# EAGLE design ADC_final (EAGLE 7.6.0)
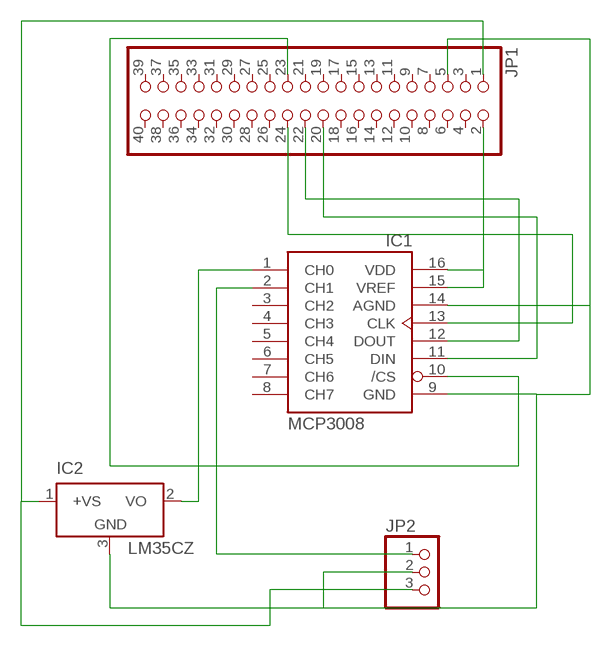
[diagram p0: schematic, sheet 1]

## Parts
IC1  MCP3008  [DIL16]
IC2  LM35CZ  [TO92]
JP1  PINHD-2X20  [2X20]
JP2  PINHD-1X3M  [1X03M]

## Nets
N$1: IC2.1(+VS) JP1.1 JP2.3
N$2: IC1.15(VREF) IC1.16(VDD) JP1.2
N$3: IC1.9(GND) IC1.14(AGND) IC2.3(GND) JP1.5 JP2.2
N$4: IC1.1(CH0) IC2.2(VO)
N$5: IC1.2(CH1) JP2.1
N$6: IC1.11(DIN) JP1.20
N$7: IC1.12(DOUT) JP1.22
N$8: IC1.13(CLK) JP1.24
N$9: IC1.10(/CS) JP1.23
Unconnected: IC1.3(CH2) IC1.4(CH3) IC1.5(CH4) IC1.6(CH5) IC1.7(CH6) IC1.8(CH7) JP1.3 JP1.4 JP1.6 JP1.7 JP1.8 JP1.9 JP1.10 JP1.11 JP1.12 JP1.13 JP1.14 JP1.15 JP1.16 JP1.17 JP1.18 JP1.19 JP1.21 JP1.25 JP1.26 JP1.27 JP1.28 JP1.29 JP1.30 JP1.31 JP1.32 JP1.33 JP1.34 JP1.35 JP1.36 JP1.37 JP1.38 JP1.39 JP1.40

## Library data of the parts
IC1 = adafruit:MCP3008
IC2 = lm35:LM35: Single-Supply Centigrade Temperature Sensor Vout = (10mV/°C x Temp °C) +5mmmV Source: http://www.national.com/ds/LM/LM35.pdf
JP1 = pinhead:PINHD-2X20: PIN HEADER
JP2 = pinhead:PINHD-1X3: PIN HEADER

## Board
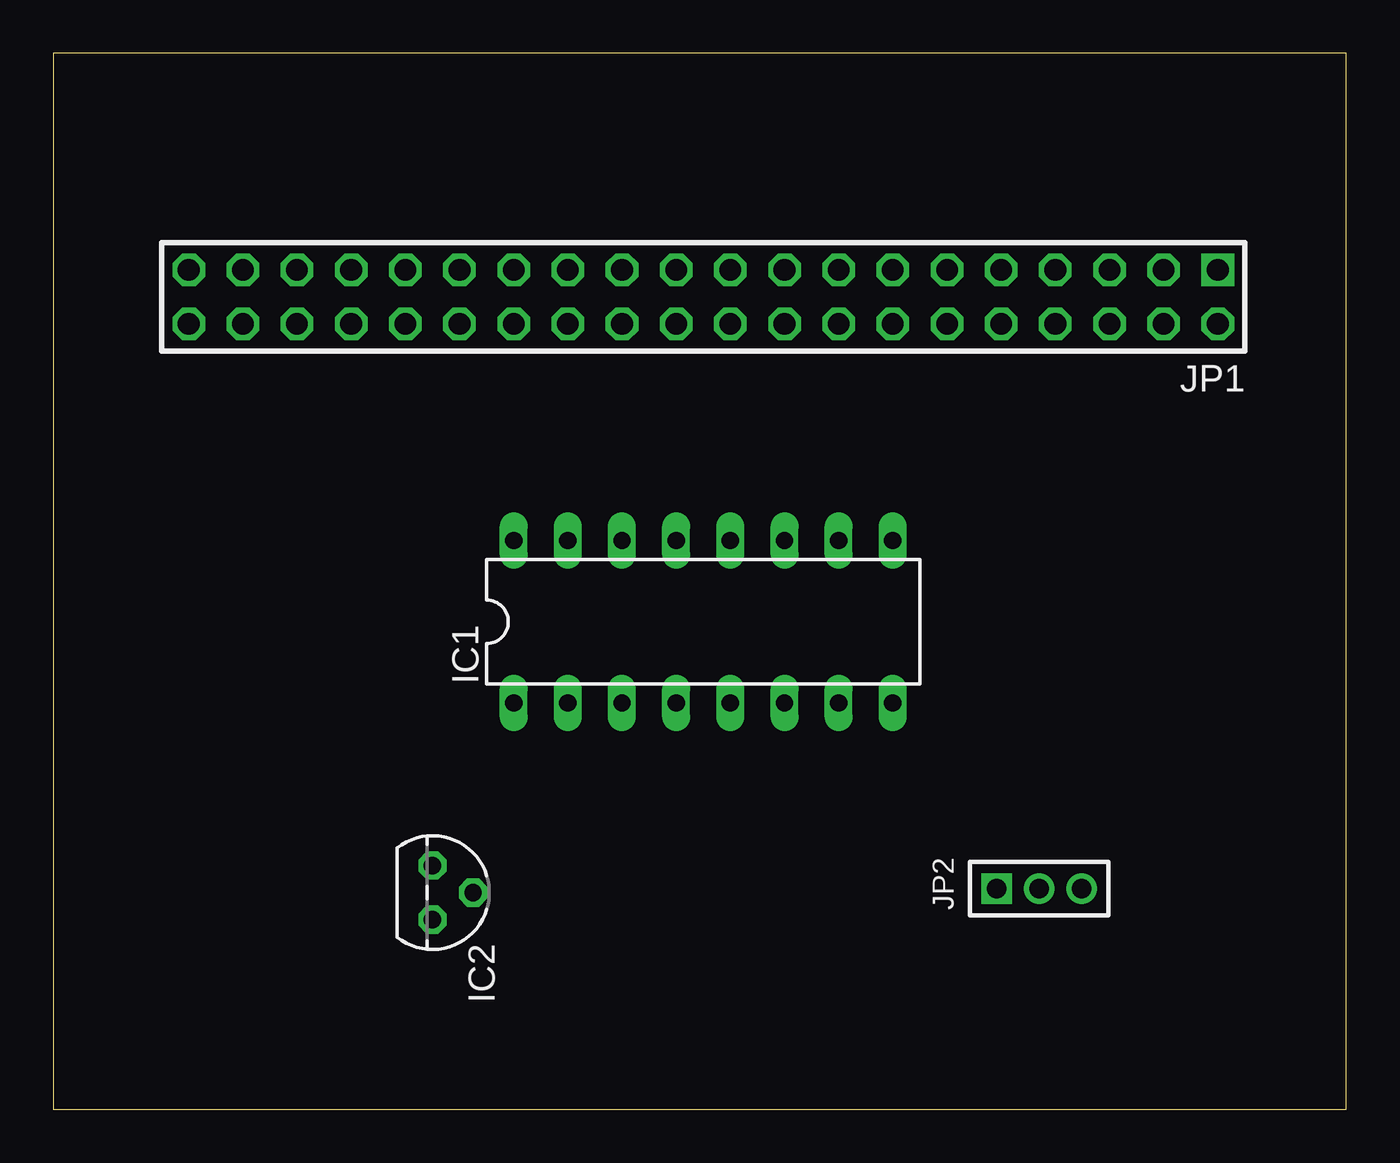
[diagram p1: board, top side]
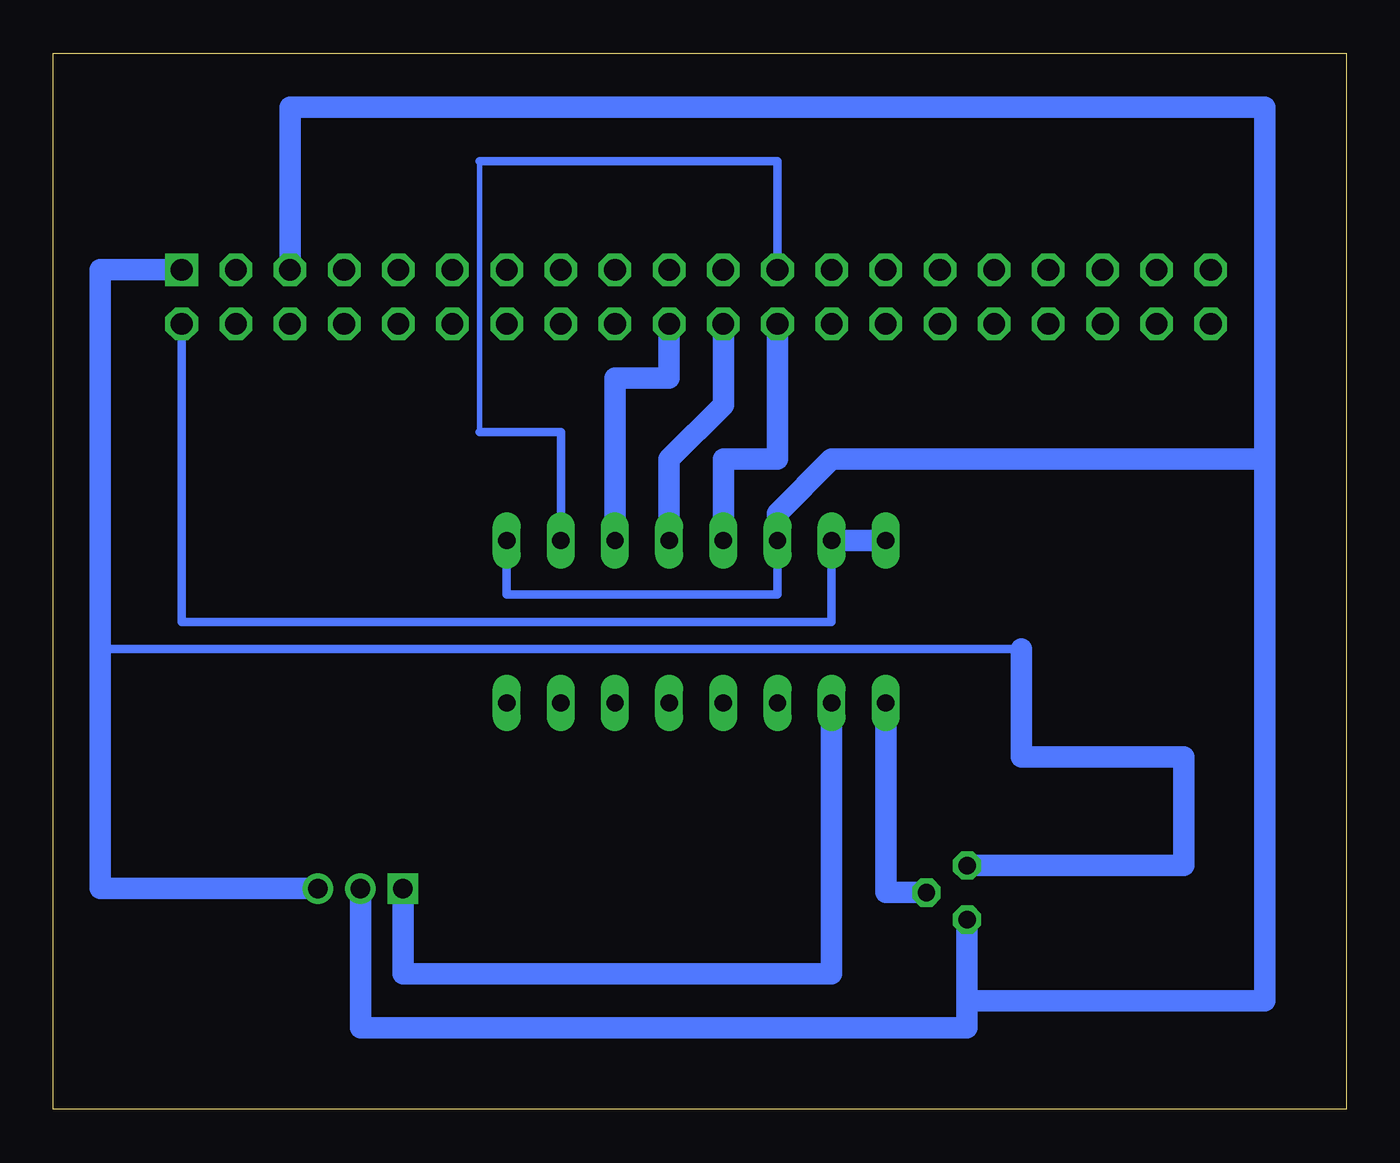
[diagram p2: board, bottom side, seen from below]

Size 60.63 x 49.52 mm. Coordinates in mm from the lower left corner, seen from the top.
Outline: 0,0 60.63,0 60.63,49.52 0,49.52 0,0
Copper layers (1*16): Top 0.035mm / dielectric 1.5mm / Bottom 0.035mm
Design rules "default": minimum track width 10mil, minimum drill 24mil, track to track 8mil, track to pad 8mil, pad to pad 8mil, via to via 8mil, smd to smd 8mil, copper to edge 40mil, drill to drill 8mil, minimum pad ring 10mil, minimum via ring 8mil, stop-mask expansion 4mil, vias tented up to drill 0mil, thermal gap 10mil

### Footprints (pad centres in the part's own frame; a part is rotated, then mirrored left to right if it is on the bottom)
DIL16 = drill 0.813 long: 1 -8.89,-3.81; 2 -6.35,-3.81; 3 -3.81,-3.81; 4 -1.27,-3.81; 5 1.27,-3.81; 6 3.81,-3.81; 7 6.35,-3.81; 8 8.89,-3.81; 9 8.89,3.81; 10 6.35,3.81; 11 3.81,3.81; 12 1.27,3.81; 13 -1.27,3.81; 14 -3.81,3.81; 15 -6.35,3.81; 16 -8.89,3.81
TO92 = drill 0.813 octagon: 1 -1.27,0; 2 0,1.905; 3 1.27,0
2X20 = drill 1.016 square: 1 -24.13,-1.27 | drill 1.016 octagon: 2 -24.13,1.27; 3 -21.59,-1.27; 4 -21.59,1.27; 5 -19.05,-1.27; 6 -19.05,1.27; 7 -16.51,-1.27; 8 -16.51,1.27; 9 -13.97,-1.27; 10 -13.97,1.27; 11 -11.43,-1.27; 12 -11.43,1.27; 13 -8.89,-1.27; 14 -8.89,1.27; 15 -6.35,-1.27; 16 -6.35,1.27; 17 -3.81,-1.27; 18 -3.81,1.27; 19 -1.27,-1.27; 20 -1.27,1.27; 21 1.27,-1.27; 22 1.27,1.27; 23 3.81,-1.27; 24 3.81,1.27; 25 6.35,-1.27; 26 6.35,1.27; 27 8.89,-1.27; 28 8.89,1.27; 29 11.43,-1.27; 30 11.43,1.27; 31 13.97,-1.27; 32 13.97,1.27; 33 16.51,-1.27; 34 16.51,1.27; 35 19.05,-1.27; 36 19.05,1.27; 37 21.59,-1.27; 38 21.59,1.27; 39 24.13,-1.27; 40 24.13,1.27
1X03M = drill 0.914 square: 1 -2,0 | drill 0.914: 2 0,0; 3 2,0

### Placement (x,y rotation side)
IC1  30.48,22.86 0 top
IC2  17.78,10.16 270 top
JP1  30.48,38.1 180 top
JP2  46.23,10.35 0 top

### Tracks (layer width: path | path; a pad name or v marks a point on that pad's centre or on a via)
N$1
  Bottom 0.406: 15.24,21.59 58.42,21.59
  Bottom 1.016: JP2.3 58.42,10.35 58.42,21.59 58.42,39.37 JP1.1 | IC2.1 7.62,11.43 7.62,16.51 15.24,16.51 15.24,21.59
N$2
  Bottom 0.406: IC1.15 24.13,22.86 54.61,22.86 JP1.2
  Bottom 1.016: IC1.15 IC1.16
N$3
  Bottom 0.406: IC1.14 26.67,24.13 39.37,24.13 IC1.9
  Bottom 1.016: IC2.3 17.78,5.08 | 17.78,5.08 17.78,3.81 46.23,3.81 JP2.2 | JP1.5 49.53,46.99 3.81,46.99 3.81,30.48 | 3.81,30.48 3.81,5.08 17.78,5.08 | IC1.14 26.67,27.94 24.13,30.48 3.81,30.48
N$4
  Bottom 1.016: IC2.2 21.59,10.16 IC1.1
N$5
  Bottom 1.016: IC1.2 24.13,6.35 44.23,6.35 JP2.1
N$6
  Bottom 1.016: JP1.20 31.75,34.29 34.29,34.29 IC1.11
N$7
  Bottom 1.016: JP1.22 29.21,33.02 31.75,30.48 IC1.12
N$8
  Bottom 1.016: JP1.24 26.67,30.48 29.21,30.48 IC1.13
N$9
  Bottom 0.254: 40.64,31.75 40.64,44.45
  Bottom 0.406: IC1.10 36.83,31.75 40.64,31.75 | 40.64,44.45 26.67,44.45 JP1.23